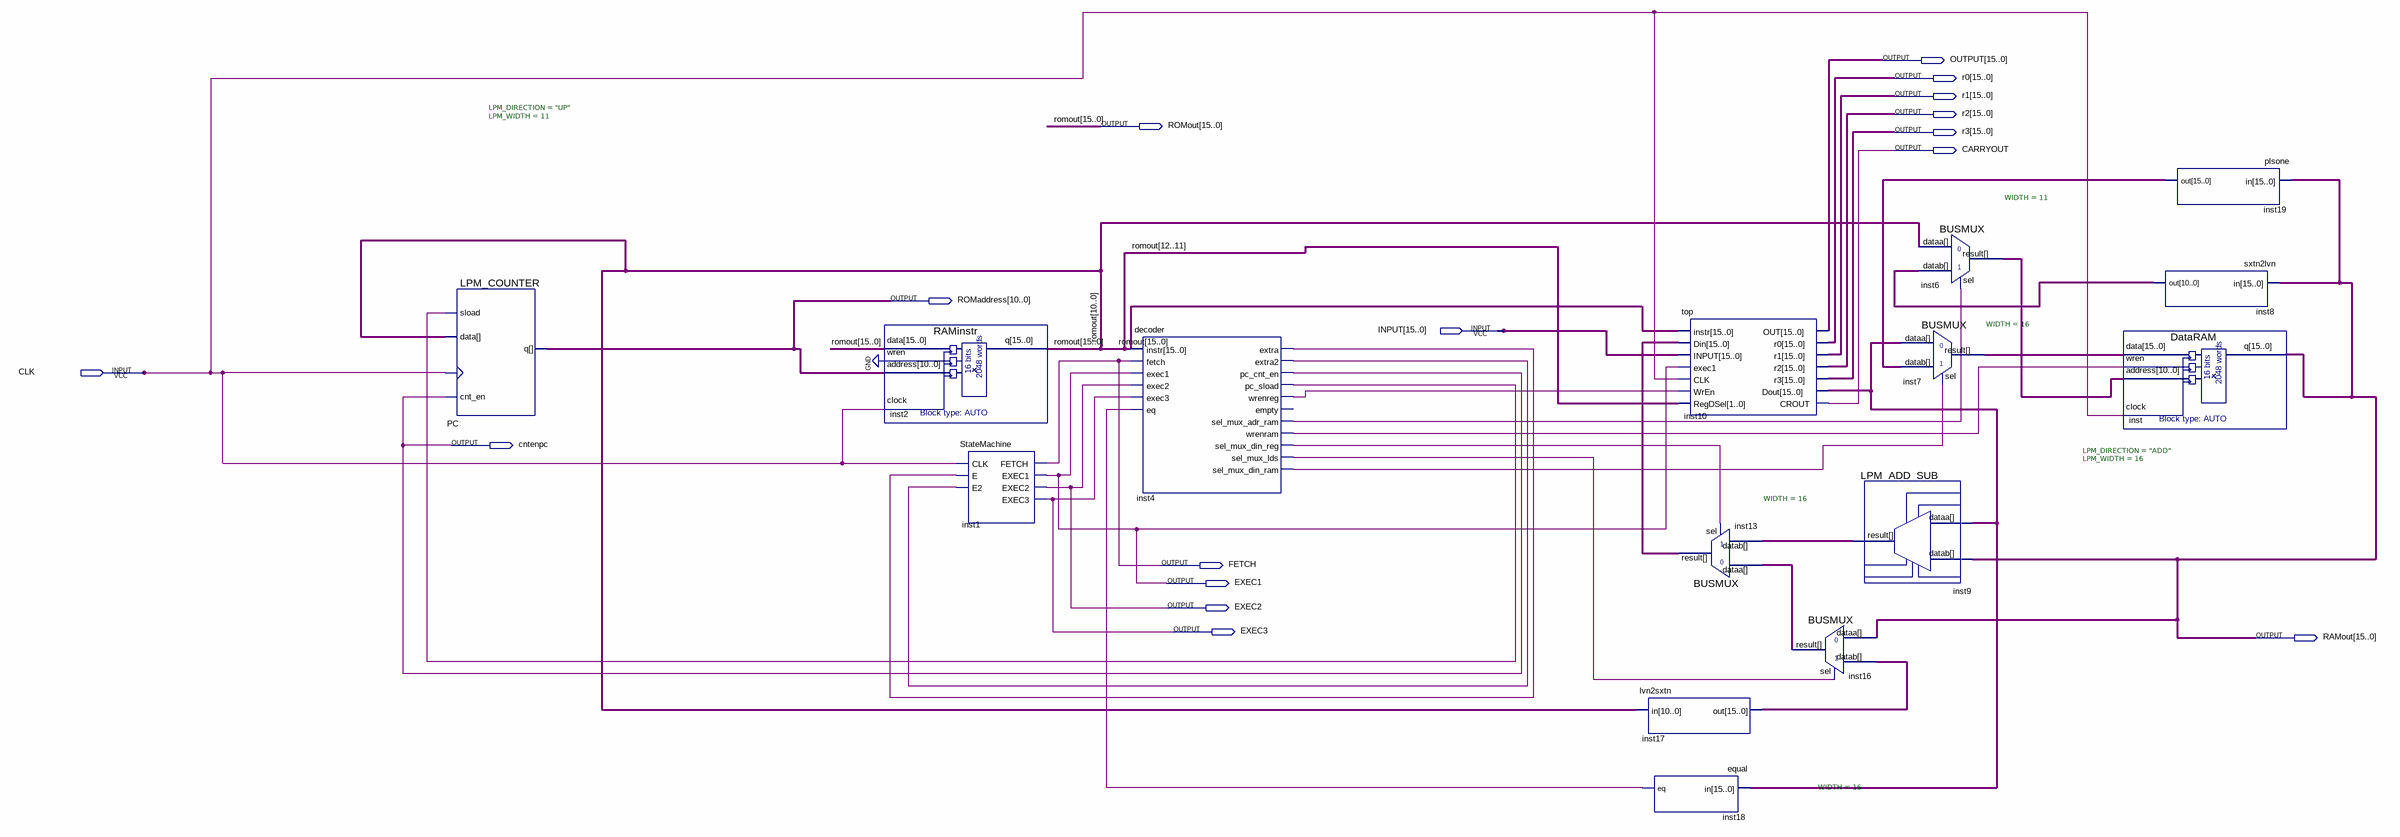
[diagram p0: schematic sheet]
// Quartus schematic CPU.bdf as structural Verilog: 15 symbols, 16 pins
module CPU (
  input  [15:0] INPUT,
  input  CLK,
  output [15:0] OUTPUT,
  output [15:0] r0,
  output [15:0] r1,
  output [15:0] r2,
  output [15:0] ROMout,
  output [15:0] r3,
  output CARRYOUT,
  output [10:0] ROMaddress,
  output cntenpc,
  output FETCH,
  output EXEC1,
  output EXEC2,
  output EXEC3,
  output [15:0] RAMout
);

  wire inst4_extra, inst4_extra2, inst4_pc_sload, inst4_sel_mux_adr_ram, inst4_sel_mux_din_ram,
       inst4_sel_mux_din_reg, inst4_sel_mux_lds, inst4_wrenram, inst4_wrenreg, inst18_eq;
  wire [10:0] inst6_result, inst8_out;
  wire [15:0] inst7_result, inst9_result, inst10_dout, inst13_result, inst16_result, inst17_out, inst19_out;

  LPM_COUNTER #(.LPM_DIRECTION("UP"), .LPM_WIDTH(11)) PC (
    .sload(inst4_pc_sload), .data(ROMout[10:0]), .clock(CLK), .cnt_en(cntenpc), .q(ROMaddress));
  RAMinstr inst2 (.data(ROMout), .wren(1'b0), .address(ROMaddress), .clock(CLK), .q(ROMout));
  StateMachine inst1 (
    .CLK(CLK), .E(inst4_extra), .E2(inst4_extra2), .FETCH(FETCH), .EXEC1(EXEC1), .EXEC2(EXEC2), .EXEC3(EXEC3));
  decoder inst4 (
    .instr(ROMout), .fetch(FETCH), .exec1(EXEC1), .exec2(EXEC2), .exec3(EXEC3), .eq(inst18_eq),
    .extra(inst4_extra), .extra2(inst4_extra2), .pc_cnt_en(cntenpc), .pc_sload(inst4_pc_sload),
    .wrenreg(inst4_wrenreg), .sel_mux_adr_ram(inst4_sel_mux_adr_ram), .wrenram(inst4_wrenram),
    .sel_mux_din_reg(inst4_sel_mux_din_reg), .sel_mux_lds(inst4_sel_mux_lds),
    .sel_mux_din_ram(inst4_sel_mux_din_ram));  // open: empty
  top inst10 (
    .instr(ROMout), .Din(inst13_result), .INPUT(INPUT), .exec1(EXEC1), .CLK(CLK), .WrEn(inst4_wrenreg),
    .RegDSel(ROMout[12:11]), .OUT(OUTPUT), .r0(r0), .r1(r1), .r2(r2), .r3(r3), .Dout(inst10_dout),
    .CROUT(CARRYOUT));
  BUSMUX #(.WIDTH(16)) inst13 (
    .datab(inst9_result), .sel(inst4_sel_mux_din_reg), .dataa(inst16_result), .result(inst13_result));
  lvn2sxtn inst17 (.in(ROMout[10:0]), .out(inst17_out));
  equal inst18 (.in(inst10_dout), .eq(inst18_eq));
  BUSMUX #(.WIDTH(16)) inst16 (.datab(inst17_out), .sel(inst4_sel_mux_lds), .dataa(RAMout), .result(inst16_result));
  LPM_ADD_SUB #(.LPM_DIRECTION("ADD"), .LPM_WIDTH(16)) inst9 (
    .datab(RAMout), .dataa(inst10_dout), .result(inst9_result));
  BUSMUX #(.WIDTH(11)) inst6 (
    .datab(inst8_out), .sel(inst4_sel_mux_adr_ram), .dataa(ROMout[10:0]), .result(inst6_result));
  BUSMUX #(.WIDTH(16)) inst7 (
    .datab(inst19_out), .sel(inst4_sel_mux_din_ram), .dataa(inst10_dout), .result(inst7_result));
  sxtn2lvn inst8 (.in(RAMout), .out(inst8_out));
  DataRAM inst (.data(inst7_result), .wren(inst4_wrenram), .address(inst6_result), .clock(CLK), .q(RAMout));
  plsone inst19 (.in(RAMout), .out(inst19_out));
endmodule
